# EAGLE design SwitchFeather (EAGLE 9.2.2)
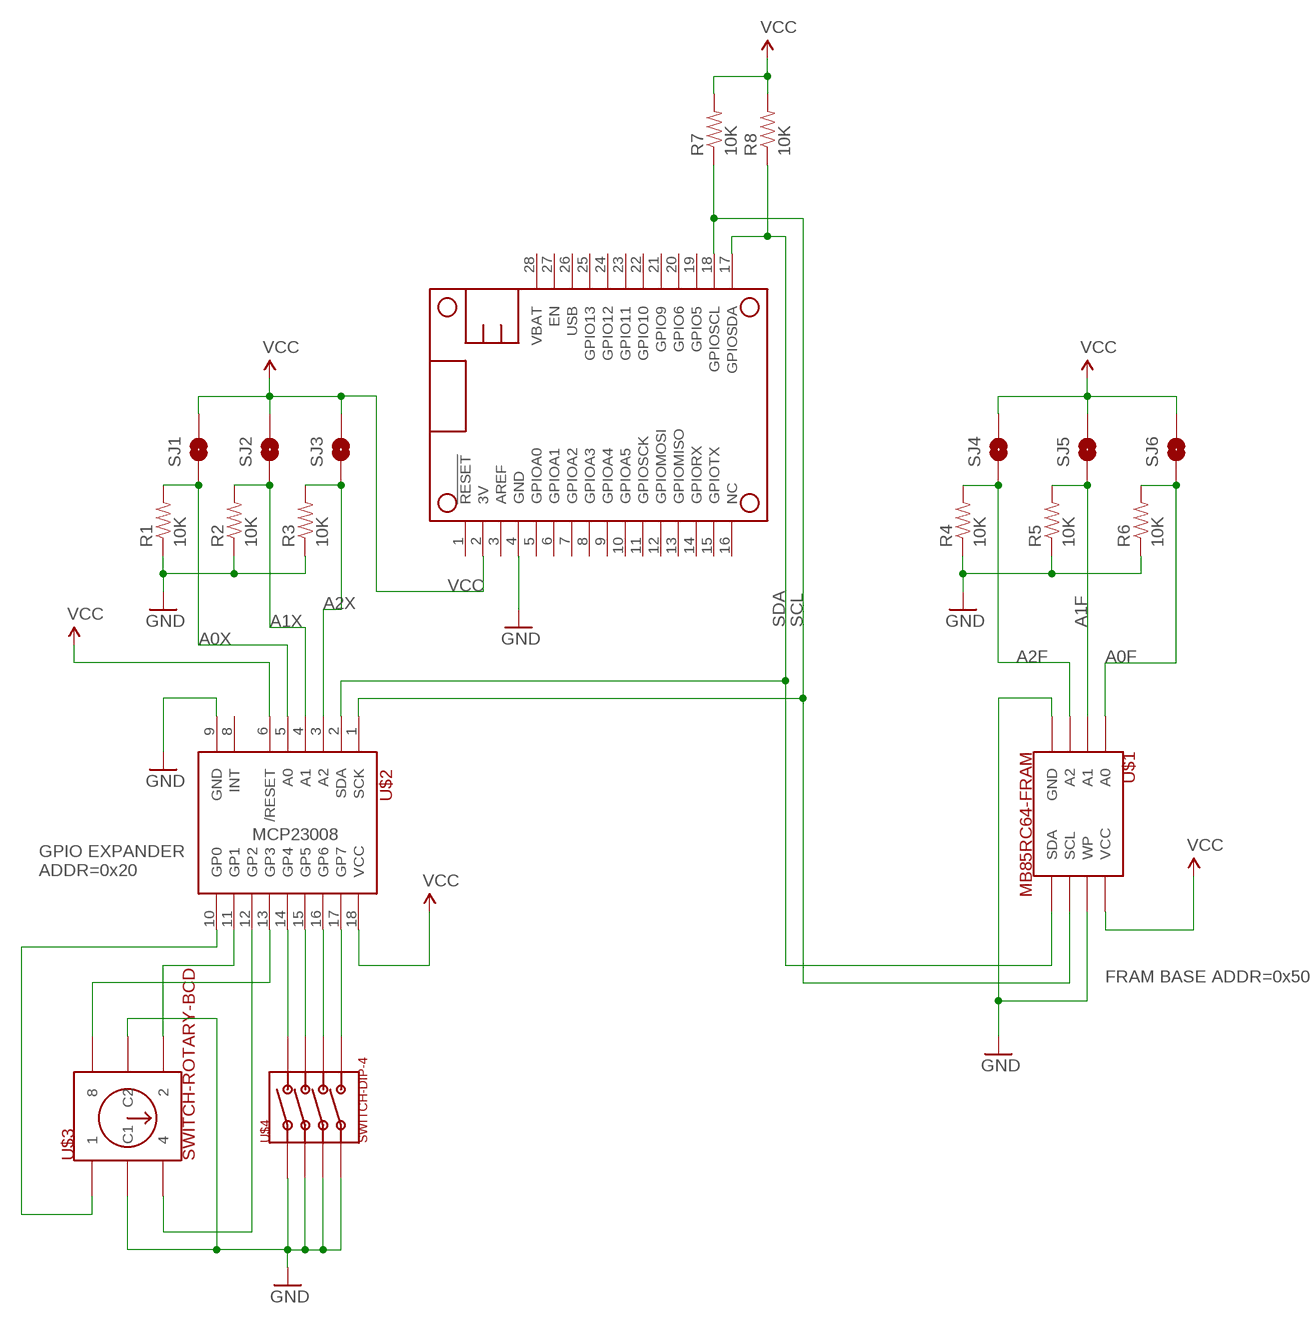
[diagram p0: schematic, sheet 1]

## Parts
MS1  FEATHERWING  [FEATHERWING]
R1  10K  RES-10K-06030603  [0603-RES]
R2  10K  RES-10K-06030603  [0603-RES]
R3  10K  RES-10K-06030603  [0603-RES]
R4  10K  RES-10K-06030603  [0603-RES]
R5  10K  RES-10K-06030603  [0603-RES]
R6  10K  RES-10K-06030603  [0603-RES]
R7  10K  RES-10K-06030603  [0603-RES]
R8  10K  RES-10K-06030603  [0603-RES]
SJ1  JUMPER-PAD-2-NO  [PAD-JUMPER-2-NO_NO_SILK]
SJ2  JUMPER-PAD-2-NO  [PAD-JUMPER-2-NO_NO_SILK]
SJ3  JUMPER-PAD-2-NO  [PAD-JUMPER-2-NO_NO_SILK]
SJ4  JUMPER-PAD-2-NO  [PAD-JUMPER-2-NO_NO_SILK]
SJ5  JUMPER-PAD-2-NO  [PAD-JUMPER-2-NO_NO_SILK]
SJ6  JUMPER-PAD-2-NO  [PAD-JUMPER-2-NO_NO_SILK]
U$1  MB85RC64-FRAM  [8-SOIC-MAXIM]
U$2  MCP23008  [SOIC-18-W-MAXIM]
U$3  SWITCH-ROTARY-BCD  [SWITCH-ROTARY-BCD]
U$4  SWITCH-DIP-4  [SWITCH-DIP-4]

## Nets
A0F: R6.2 SJ6.1 U$1.1(A0)
A0X: R1.2 SJ1.1 U$2.5(A0)
A1F: R5.2 SJ5.1 U$1.2(A1)
A1X: R2.2 SJ2.1 U$2.4(A1)
A2F: R4.2 SJ4.1 U$1.3(A2)
A2X: R3.2 SJ3.1 U$2.3(A2)
GND: MS1.4(GND) R1.1 R2.1 R3.1 R4.1 R5.1 R6.1 U$1.4(GND) U$1.7(WP) U$2.9(GND) U$3.P$2(C1) U$3.P$5(C2) U$4.P$1 U$4.P$3 U$4.P$5 U$4.P$7
GP0: U$2.10(GP0) U$3.P$1
GP1: U$2.11(GP1) U$3.P$4
GP2: U$2.12(GP2) U$3.P$3
GP3: U$2.13(GP3) U$3.P$6
GP4: U$2.14(GP4) U$4.P$2
GP5: U$2.15(GP5) U$4.P$4
GP6: U$2.16(GP6) U$4.P$6
GP7: U$2.17(GP7) U$4.P$8
SCL: MS1.18(GPIOSCL) R7.1 U$1.6(SCL) U$2.1(SCK)
SDA: MS1.17(GPIOSDA) R8.1 U$1.5(SDA) U$2.2(SDA)
VCC: MS1.2(3V) R7.2 R8.2 SJ1.2 SJ2.2 SJ3.2 SJ4.2 SJ5.2 SJ6.2 U$1.8(VCC) U$2.6(/RESET) U$2.18(VCC)
Unconnected: MS1.1(!RESET) MS1.3(AREF) MS1.5(GPIOA0) MS1.6(GPIOA1) MS1.7(GPIOA2) MS1.8(GPIOA3) MS1.9(GPIOA4) MS1.10(GPIOA5) MS1.11(GPIOSCK) MS1.12(GPIOMOSI) MS1.13(GPIOMISO) MS1.14(GPIORX) MS1.15(GPIOTX) MS1.16(NC) MS1.19(GPIO5) MS1.20(GPIO6) MS1.21(GPIO9) MS1.22(GPIO10) MS1.23(GPIO11) MS1.24(GPIO12) MS1.25(GPIO13) MS1.26(USB) MS1.27(EN) MS1.28(VBAT) U$2.8(INT)

## Notes on the sheet
- MCP23008
- GPIO EXPANDER
  ADDR=0x20
- FRAM BASE ADDR=0x50

## Library data of the parts
MS1 = microbuilder:FEATHERWING
R1-R8 = rickk2:RES-10K-0603: RES SMD 10K OHM 5% 1/4W 0603 $ 0.10 https://www.digikey.com/product-detail/en/panasonic-electronic-components/ERJ-PA3J103V/P10KBZCT-ND/5036237
SJ1-SJ6 = rickk2:JUMPER-PAD-2-NO
U$1 = rickk2:MB85RC64-FRAM: Fujitsu MB85RC64TAPNF-G-BDERE1 IC FRAM 64K I2C 3.4MHZ 8SOP $ 1.58 FRAM (Ferroelectric RAM) Memory IC 64Kb (8K x 8) I²C 3.4MHz 8-SOP https://www.digikey.com/product-detail/en/fujitsu-electronics-america-inc/MB85RC64TAPNF-G-BDERE1/865-1274-1-ND/6802280
U$2 = rickk2:MCP23008: IC I/O EXPANDER I2C 8B 18SOIC $1.08 https://www.digikey.com/product-detail/en/microchip-technology/MCP23008T-E-SO/MCP23008T-E-SOCT-ND/5358243
U$3 = rickk2:SWITCH-ROTARY-BCD: Dip Switch BCD 10 Position Through Hole Rotary with Shaft Actuator 100mA 50VDC CTS Electrocomponents 220ADC10 $2.26 https://www.digikey.com/product-detail/en/220ADC10/CT3069-ND/4743855/?itemSeq=273765935
U$4 = rickk2:SWITCH-DIP-4: Dip Switch SPST 4 Position Through Hole Slide (Standard) Actuator 100mA 20VDC CTS Electrocomponents 209-4MS $0.69 https://www.digikey.com/product-detail/en/cts-electrocomponents/209-4MS/CT2094MS-ND/217664

## Board
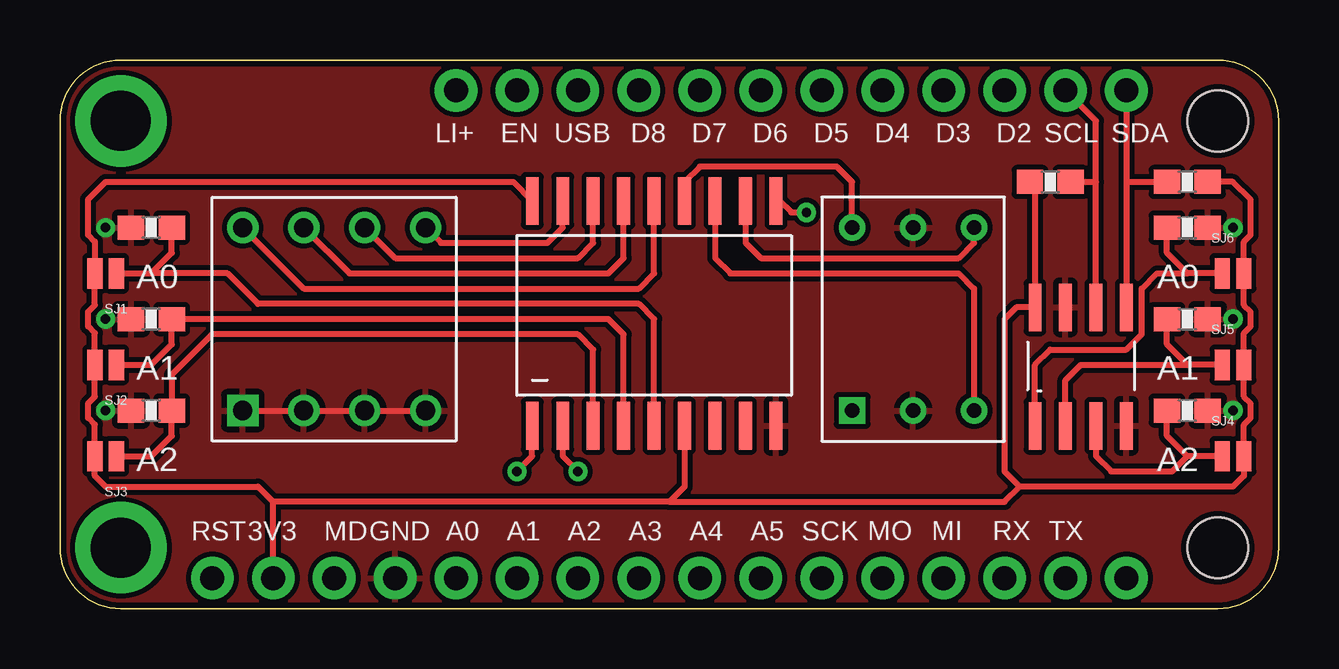
[diagram p1: board, top side]
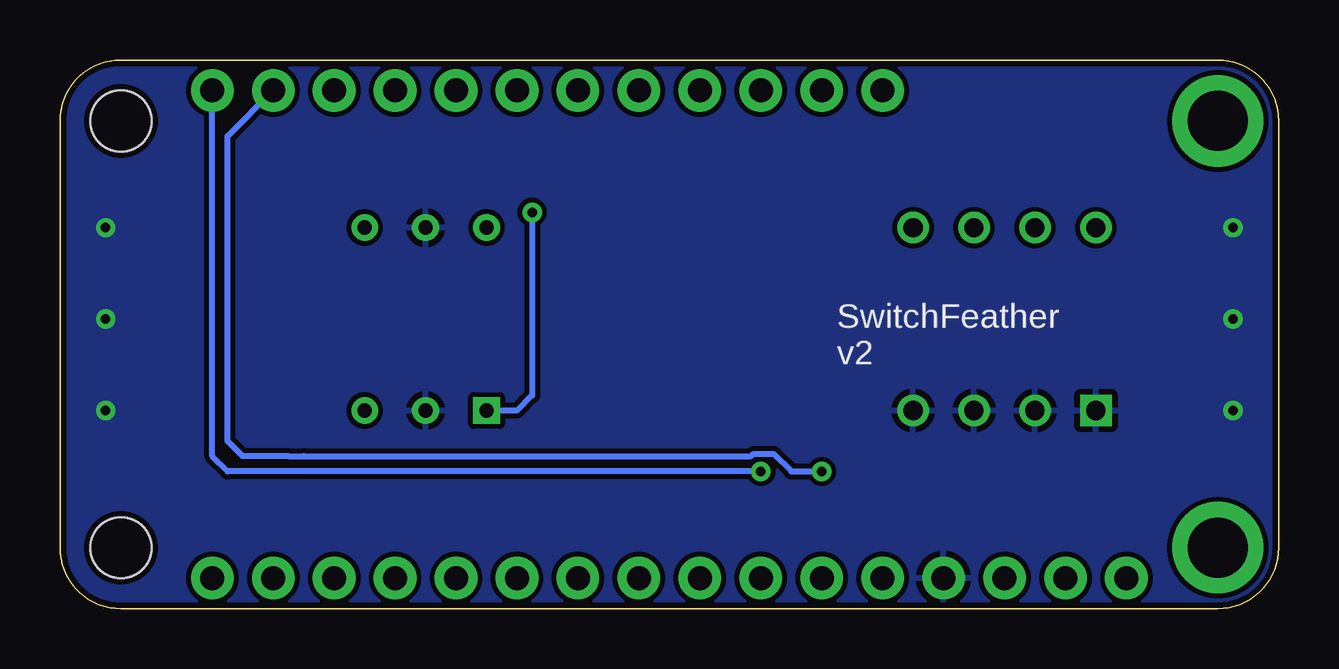
[diagram p2: board, bottom side, seen from below]

Size 50.8 x 22.86 mm. Coordinates in mm from the lower left corner, seen from the top.
Outline: 2.54,22.86 48.26,22.86 arc-90 50.8,20.32 50.8,2.54 arc-90 48.26,0 2.54,0 arc-90 0,2.54 0,20.32 arc-90 2.54,22.86
Copper layers (1*16): Top 0.035mm / dielectric 1.5mm / Bottom 0.035mm
Design rules "adafruit": minimum track width 8mil, minimum drill 15.5mil, track to track 8mil, track to pad 8mil, pad to pad 8mil, via to via 8mil, smd to smd 8mil, copper to edge 10mil, drill to drill 8mil, minimum pad ring 10mil, minimum via ring 8mil, stop-mask expansion 2mil, vias tented up to drill 20mil, thermal gap 10mil

### Footprints (pad centres in the part's own frame; a part is rotated, then mirrored left to right if it is on the bottom)
FEATHERWING = drill 1 pad 1.778: 1 6.35,1.27; 2 8.89,1.27; 3 11.43,1.27; 4 13.97,1.27; 5 16.51,1.27; 6 19.05,1.27; 7 21.59,1.27; 8 24.13,1.27; 9 26.67,1.27; 10 29.21,1.27; 11 31.75,1.27; 12 34.29,1.27; 13 36.83,1.27; 14 39.37,1.27; 15 41.91,1.27; 16 44.45,1.27; 17 44.45,21.59; 18 41.91,21.59; 19 39.37,21.59; 20 36.83,21.59; 21 34.29,21.59; 22 31.75,21.59; 23 29.21,21.59; 24 26.67,21.59; 25 24.13,21.59; 26 21.59,21.59; 27 19.05,21.59; 28 16.51,21.59 | drill 2.5 pad 3.81: P$1 2.54,20.32; P$2 2.54,2.54 | hole 2.54: 48.26,20.32; 48.26,2.54
0603-RES = smd 1.1 x 1: 1 -0.85,0; 2 0.85,0
PAD-JUMPER-2-NO_NO_SILK = smd 0.635 x 1.27: 1 -0.45,0; 2 0.45,0
8-SOIC-MAXIM = smd 0.53 x 1.98: 1 0,0; 2 1.27,0; 3 2.54,0; 4 3.81,0; 5 3.81,4.93; 6 2.54,4.93; 7 1.27,4.93; 8 0,4.93
SOIC-18-W-MAXIM = smd 0.533 x 1.981: 1 0,0; 2 1.27,0; 3 2.54,0; 4 3.81,0; 5 5.08,0; 6 6.35,0; 7 7.62,0; 8 8.89,0; 9 10.16,0; 10 10.16,9.373; 11 8.89,9.373; 12 7.62,9.373; 13 6.35,9.373; 14 5.08,9.373; 15 3.81,9.373; 16 2.54,9.373; 17 1.27,9.373; 18 0,9.373
SWITCH-ROTARY-BCD = drill 0.6 square: P$1 0,0 | drill 0.6: P$2 2.54,0; P$3 5.08,0; P$4 5.08,7.62; P$5 2.54,7.62; P$6 0,7.62
SWITCH-DIP-4 = drill 0.8 square: P$1 0,0 | drill 0.8: P$2 0,7.62; P$3 2.54,0; P$4 2.54,7.62; P$5 5.08,0; P$6 5.08,7.62; P$7 7.62,0; P$8 7.62,7.62

### Placement (x,y rotation side)
MS1  0,0 0 top
R1  3.81,15.88 0 top
R2  3.81,12.06 0 top
R3  3.81,8.26 0 top
R4  46.99,8.26 180 top
R5  46.99,12.06 180 top
R6  46.99,15.88 180 top
R7  41.27,17.78 180 top
R8  46.99,17.78 0 top
SJ1  1.91,13.97 180 top
SJ2  1.91,10.16 180 top
SJ3  1.91,6.35 180 top
SJ4  48.9,6.35 0 top
SJ5  48.9,10.16 0 top
SJ6  48.9,13.97 0 top
U$1  40.64,7.62 0 top
U$2  19.68,7.62 0 top
U$3  33.02,8.26 0 top
U$4  7.62,8.26 0 top

### Tracks (layer width: path | path; a pad name or v marks a point on that pad's centre or on a via)
A0F
  Top 0.254: SJ6.1 46.99,13.97 | 46.99,13.97 46.14,14.82 R6.2 | 46.99,13.97 45.72,13.97 45.09,13.34 45.09,11.43 44.45,10.79 41.27,10.79 40.64,10.16 U$1.1
A0X
  Top 0.254: U$2.5 24.77,12.06 24.13,12.7 8.26,12.7 6.99,13.97 3.81,13.97 | SJ1.1 3.81,13.97 | 3.81,13.97 4.66,14.82 R1.2
A1F
  Top 0.254: SJ5.1 46.99,10.16 | 46.99,10.16 46.14,11.01 R5.2 | U$1.2 41.91,9.53 42.55,10.16 46.99,10.16
A1X
  Top 0.254: U$2.4 23.5,11.43 22.86,12.06 R2.2 4.66,11.01 3.81,10.16 SJ2.1
A2F
  Top 0.254: SJ4.1 46.99,6.35 | 46.99,6.35 46.14,7.2 R4.2 | U$1.3 43.18,6.35 43.81,5.71 46.35,5.71 46.99,6.35
A2X
  Top 0.254: U$2.3 22.23,10.79 21.59,11.43 6.35,11.43 4.66,9.74 R3.2 4.66,7.2 3.81,6.35 SJ3.1
GND  (via drill 0.39)
  Top 0.254: U$4.P$1 U$4.P$3 U$4.P$5 U$4.P$7
  other vias: 1.91,15.88 1.91,12.06 1.91,8.26 48.9,15.88 48.9,12.06 48.9,8.26
  pour Top: 0,0 0,25.4 53.34,25.4 53.34,0
  pour Bottom: 0,0 0,27.94 55.88,27.94 55.88,0
GP0  (via drill 0.39)
  Top 0.254: U$2.10 30,16.99 30.48,16.51 v31.11,16.51
  Bottom 0.254: v31.11,16.51 31.11,8.89 31.75,8.26 U$3.P$1
GP1
  Top 0.254: U$2.11 28.57,15.24 29.21,14.61 37.47,14.61 38.1,15.24 U$3.P$4
GP2
  Top 0.254: U$2.12 27.3,14.61 27.94,13.97 37.47,13.97 38.1,13.34 U$3.P$3
GP3
  Top 0.254: U$3.P$6 33.02,17.78 32.38,18.41 26.67,18.41 26.04,17.78 U$2.13
GP4
  Top 0.254: U$4.P$2 10.16,13.34 24.13,13.34 24.77,13.97 U$2.14
GP5
  Top 0.254: U$4.P$4 12.06,13.97 22.86,13.97 23.5,14.61 U$2.15
GP6
  Top 0.254: U$4.P$6 13.97,14.61 21.59,14.61 22.23,15.24 U$2.16
GP7
  Top 0.254: U$4.P$8 15.88,15.24 20.32,15.24 20.95,15.88 U$2.17
SCL  (via drill 0.39)
  Top 0.254: U$1.6 43.18,17.78 | 43.18,17.78 43.18,20.32 MS1.18 | R7.1 43.18,17.78 | v19.05,5.71 19.68,6.35 U$2.1
  Bottom 0.254: v19.05,5.71 20.32,5.71 21.05,6.45 21.89,6.45 21.99,6.35 40.64,6.35 41.27,6.35 43.18,6.35 43.81,6.99 43.81,19.68 MS1.18
SDA  (via drill 0.39)
  Top 0.254: MS1.17 44.45,17.78 | 44.45,17.78 U$1.5 | 44.45,17.78 R8.1 | U$2.2 20.95,6.35 v21.59,5.71
  Bottom 0.254: v21.59,5.71 43.81,5.71 44.45,6.35 MS1.17
VCC
  Top 0.254: U$2.18 18.9,17.78 1.91,17.78 1.18,17.05 1.18,15.57 1.46,15.29 SJ1.2 1.46,12.65 1.18,12.37 1.18,11.76 1.46,11.48 SJ2.2 1.46,8.84 1.18,8.56 1.18,7.95 1.46,7.67 SJ3.2 1.46,5.53 1.91,5.08 8.26,5.08 8.89,4.45 | MS1.2 8.89,4.45 | R8.2 48.9,17.78 49.62,17.05 49.62,15.57 49.34,15.29 SJ6.2 49.34,12.65 49.62,12.37 49.62,11.76 49.34,11.48 SJ5.2 49.34,8.84 49.62,8.56 49.62,7.95 49.34,7.67 SJ4.2 49.34,5.53 48.9,5.08 40.01,5.08 | R7.2 40.64,17.57 U$1.8 39.85,12.55 39.37,12.06 39.37,5.71 40.01,5.08 | U$2.6 26.04,5.08 25.4,4.45 | 25.4,4.45 8.89,4.45 | 25.4,4.45 39.37,4.45 40.01,5.08

### Text on the board
tPlace: LI+ | EN | USB | D8 | D7 | D6 | D5 | D4 | D3 | D2 | SCL | SDA | A0 | A0 | A1 | A1 | A2 | A2 | RST | 3V3 | MD | GND | A0 | A1 | A2 | A3 | A4 | A5 | SCK | MO | MI | RX | TX
bPlace: SwitchFeather / v2